# Altium schematic sheet Motor_Board.SchDoc
size A4; DrawnBy: Mike Cusdin; Organization: University of Canterbury; Address1: Electrical & Computer Eng; Address2: Private Bag 4800; Address3: Christchurch 8020; Address4: New Zealand; Revision: 2.0
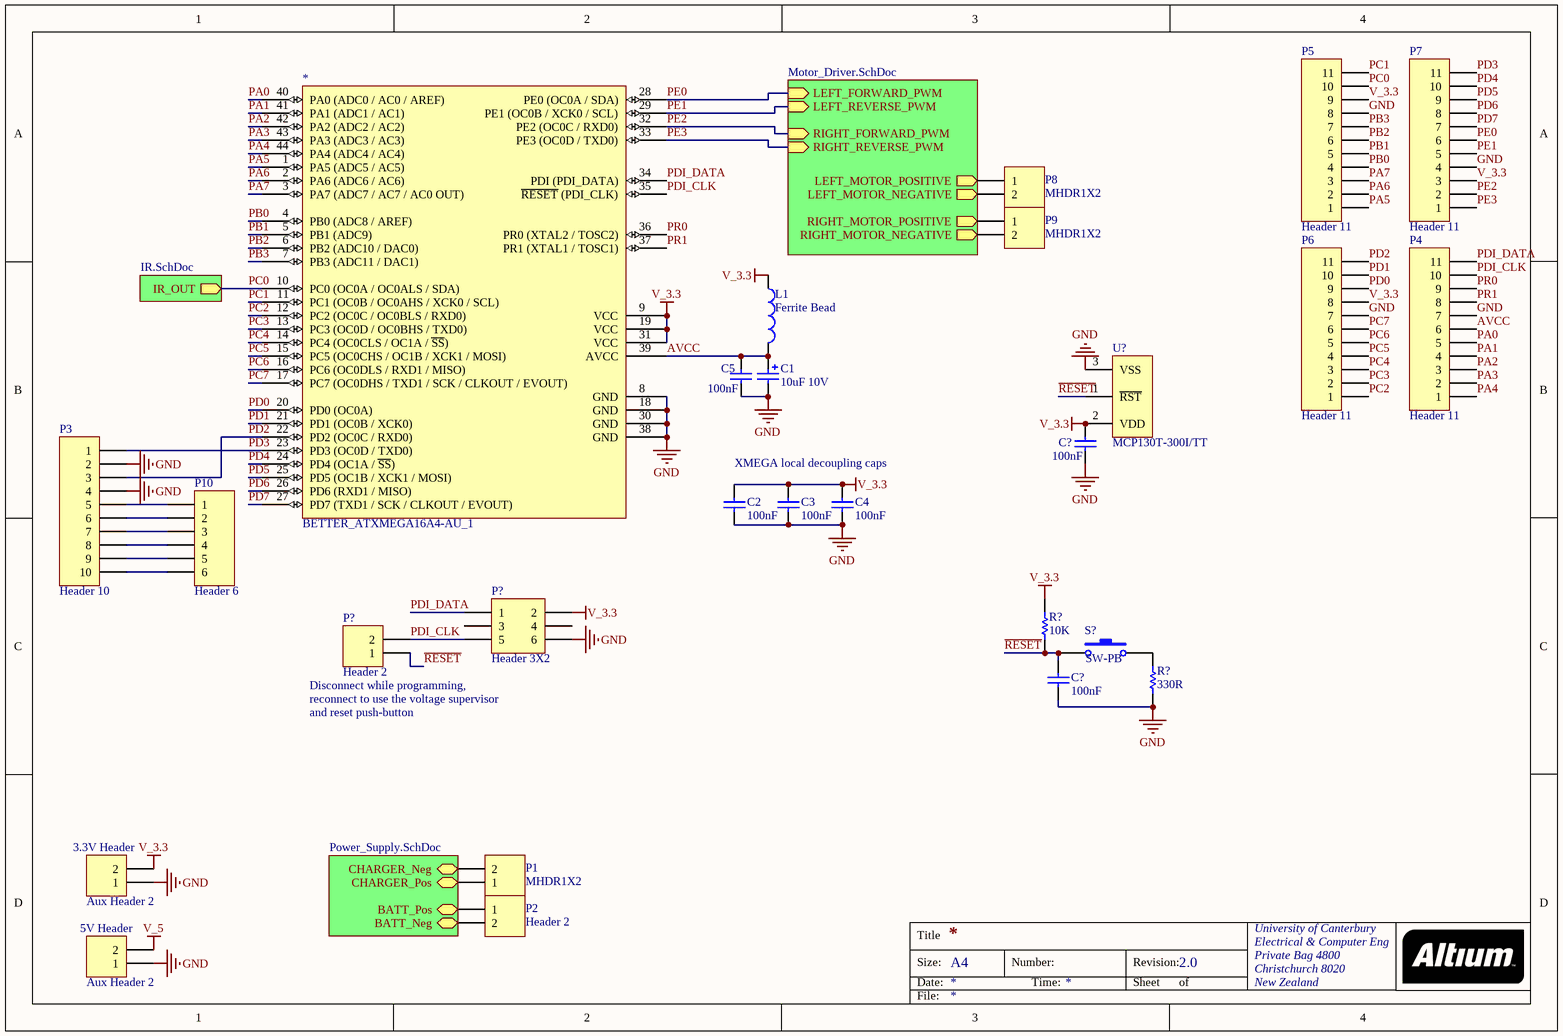
[diagram p0: Motor_Board.SchDoc]

## Parts
(Parts that share a designator on the sheet are numbered #1, #2 ... from top to bottom, then left to right.)
3.3V_Header  Aux Header 2  [TMHDR2]
5V_Header  Aux Header 2  [TMHDR2]
*  BETTER_ATXMEGA16A4-AU_1  [TQFP80P1200X1200X120-44N]
C1  10uF 10V  [TANT3216]
C2  100nF  [CC0603]
C3  100nF  [CC0603]
C4  100nF  [CC0603]
C5  100nF  [CC0603]
C?#1  100nF  [CC0603]
C?#2  100nF  [CC0603]
L1  Ferrite Bead  [R0805]
P1  MHDR1X2  [MHDR1X2]
P2  Header 2  [HDR1X2]
P3  Header 10  [HDR1X10]
P4  Header 11  [HDR1X11]
P5  Header 11  [HDR1X11]
P6  Header 11  [HDR1X11]
P7  Header 11  [HDR1X11]
P8  MHDR1X2  [MHDR1X2]
P9  MHDR1X2  [MHDR1X2]
P10  Header 6  [HDR1X6]
P?#1  Header 3X2  [HDR2X3]
P?#2  Header 2  [HDR1X2]
R?#1  10K  [R0603]
R?#2  330R  [R0603]
S?  SW-PB  [SPST-2]
U?  MCP130T-300I/TT  [SOT-23-TT3_N]

## Sub-sheets
? = Power_Supply.SchDoc: BATT_Pos, CHARGER_Neg, CHARGER_Pos, BATT_Neg
? = Motor_Driver.SchDoc: LEFT_FORWARD_PWM (in), RIGHT_FORWARD_PWM (in), LEFT_MOTOR_POSITIVE (out), RIGHT_MOTOR_POSITIVE (out), RIGHT_REVERSE_PWM (in), LEFT_REVERSE_PWM (in), RIGHT_MOTOR_NEGATIVE (out), LEFT_MOTOR_NEGATIVE (out)
? = IR.SchDoc: IR_OUT (out)

## Nets
GND: 3.3V_Header.?1(1) 5V_Header.?1(1) *.8(GND) *.18(GND) *.30(GND) *.38(GND) C1.2 C2.1 C3.1 C4.1 C5.1 C?#1.2 C?#2.2 P3.2 P3.4 P4.7 P5.8 P6.7 P7.4 P?#1.6 R?#2.1 U?.3(VSS)
V_3.3: 3.3V_Header.?2(2) *.9(VCC) *.19(VCC) *.31(VCC) C2.2 C3.2 C4.2 C?#1.1 L1.1 P5.9 P6.8 P7.3 P?#1.2 R?#1.2 U?.2(VDD)
V_5: 5V_Header.?2(2)
AVCC: *.39(AVCC) C1.1 C5.2 L1.2 P4.6
PA0: *.40(PA0_(ADC0_/_AC0_/_AREF)) P4.5
PA1: *.41(PA1_(ADC1_/_AC1)) P4.4
PA2: *.42(PA2_(ADC2_/_AC2)) P4.3
PA3: *.43(PA3_(ADC3_/_AC3)) P4.2
PA4: *.44(PA4_(ADC4_/_AC4)) P4.1
PA5: *.1(PA5_(ADC5_/_AC5)) P5.1
PA6: *.2(PA6_(ADC6_/_AC6)) P5.2
PA7: *.3(PA7_(ADC7_/_AC7_/_AC0_OUT)) P5.3
PB0: *.4(PB0_(ADC8_/_AREF)) P5.4
PB1: *.5(PB1_(ADC9)) P5.5
PB2: *.6(PB2_(ADC10_/_DAC0)) P5.6
PB3: *.7(PB3_(ADC11_/_DAC1)) P5.7
PC0: *.10(PC0_(OC0A_/_OC0ALS_/_SDA)) P5.10 ; sheet /IR_OUT
PC1: *.11(PC1_(OC0B_/_OC0AHS_/_XCK0_/_SCL)) P5.11
PC2: *.12(PC2_(OC0C_/_OC0BLS_/_RXD0)) P6.1
PC3: *.13(PC3_(OC0D_/_OC0BHS_/_TXD0)) P6.2
PC4: *.14(PC4_(OC0CLS_/_OC1A_/_~{SS})) P6.3
PC5: *.15(PC5_(OC0CHS_/_OC1B_/_XCK1_/_MOSI)) P6.4
PC6: *.16(PC6_(OC0DLS_/_RXD1_/_MISO)) P6.5
PC7: *.17(PC7_(OC0DHS_/_TXD1_/_SCK_/_CLKOUT_/_EVOUT)) P6.6
PD0: *.20(PD0_(OC0A)) P6.9
PD1: *.21(PD1_(OC0B_/_XCK0)) P6.10
PD2: *.22(PD2_(OC0C_/_RXD0)) P3.3 P6.11
PD3: *.23(PD3_(OC0D_/_TXD0)) P3.1 P7.11
PD4: *.24(PD4_(OC1A_/_~{SS})) P7.10
PD5: *.25(PD5_(OC1B_/_XCK1_/_MOSI)) P7.9
PD6: *.26(PD6_(RXD1_/_MISO)) P7.8
PD7: *.27(PD7_(TXD1_/_SCK_/_CLKOUT_/_EVOUT)) P7.7
PDI_CLK: *.35(~{RESET}_(PDI_CLK)) P4.10 P?#1.5 P?#2.2
PDI_DATA: *.34(PDI_(PDI_DATA)) P4.11 P?#1.1
PE0: *.28(PE0_(OC0A_/_SDA)) P7.6 ; sheet /LEFT_FORWARD_PWM
PE1: *.29(PE1_(OC0B_/_XCK0_/_SCL)) P7.5 ; sheet /LEFT_REVERSE_PWM
PE2: *.32(PE2_(OC0C_/_RXD0)) P7.2 ; sheet /RIGHT_FORWARD_PWM
PE3: *.33(PE3_(OC0D_/_TXD0)) P7.1 ; sheet /RIGHT_REVERSE_PWM
PR0: *.36(PR0_(XTAL2_/_TOSC2)) P4.9
PR1: *.37(PR1_(XTAL1_/_TOSC1)) P4.8
~{RESET}: C?#2.1 P?#2.1 R?#1.1 S?.1 U?.1(~{RST})
NetP1_1: P1.1 ; sheet /CHARGER_Pos
NetP1_2: P1.2 ; sheet /CHARGER_Neg
NetP2_1: P2.1 ; sheet /BATT_Pos
NetP2_2: P2.2 ; sheet /BATT_Neg
NetP3_5: P3.5 P10.1
NetP3_6: P3.6 P10.2
NetP3_7: P3.7 P10.3
NetP3_8: P3.8 P10.4
NetP3_9: P3.9 P10.5
NetP3_10: P3.10 P10.6
NetP8_1: P8.1 ; sheet /LEFT_MOTOR_POSITIVE
NetP8_2: P8.2 ; sheet /LEFT_MOTOR_NEGATIVE
NetP9_1: P9.1 ; sheet /RIGHT_MOTOR_POSITIVE
NetP9_2: P9.2 ; sheet /RIGHT_MOTOR_NEGATIVE
NetR?#2_2: R?#2.2 S?.2

Not connected (* = marked no-connect by the designer): P?#1 3 4

## Notes on the sheet
- XMEGA local decoupling caps
- (near P?#2) Disconnect while programming,
- (near P?#2) reconnect to use the voltage supervisor
- and reset push-button
- Title
- Size:
- Date:
- A4
- Number:
- Time:
- Revision:
- Sheet
- of
- File:

## Library data of the parts
3.3V_Header 5V_Header = Aux Header 2: 5.08mm Pluggable Terminal Header; LatestRevisionDate: 17-Jul-2002; LatestRevisionNote: Re-released for DXP Platform.; Publisher: Altium Limited
C1 = TANT10uF_10V_3216: SM Tantalum Cap; Supplier_Component_Code: RZ-6550; published: 12/03/2007 11:34:36 a.m.; Supplier_Name: Soanar Plus; price: 1.7; value: 10uF 10V; Part Number: TANT10uF_10V_3216; Component Kind: Standard; Component Type: Standard; Designator: TANT10uF_10V_3216; Pin Count: 2
C2-C5 C?#1 C?#2 = 100nF_CC0603: 0603 Capacitor; Supplier_Component_Code: RC-P100; published: 28/03/2007 10:54:57 a.m.; Supplier_Name: Soanar Plus; price: 0.09; value: 100nF; Part Number: 100nF_CC0603; Component Kind: Standard; Component Type: Standard; Designator: 100nF_CC0603; Pin Count: 2
L1 = L805: Ferrite Bead Inductor; Value: 100R; Published: 8-Jun-2000; LatestRevisionDate: 17-Jul-2002; Publisher: Altium Limited; price: 0.11; Supplier_Component_Code: LF-P308; Supplier_Name: Soanar Plus; Part Number: L805; Component Kind: Standard; Component Type: Standard; Designator: L805; Pin Count: 2; Signal Integrity: Inductor; Simulation: INDUCTOR
P1 P8 P9 = MHDR1X2: Header, 2-Pin; LatestRevisionDate: 17-Jul-2002; LatestRevisionNote: Re-released for DXP Platform.; Publisher: Altium Limited
P2 P?#2 = Header 2: Header, 2-Pin; LatestRevisionDate: 17-Jul-2002; LatestRevisionNote: Re-released for DXP Platform.; Publisher: Altium Limited
P3 = Header 10: Header, 10-Pin; LatestRevisionDate: 17-Jul-2002; LatestRevisionNote: Re-released for DXP Platform.; Publisher: Altium Limited
P4-P7 = Header 11: Header, 11-Pin; LatestRevisionDate: 17-Jul-2002; LatestRevisionNote: Re-released for DXP Platform.; Publisher: Altium Limited
P10 = Header 6: Header, 6-Pin; LatestRevisionDate: 17-Jul-2002; LatestRevisionNote: Re-released for DXP Platform.; Publisher: Altium Limited
P?#1 = Header 3X2: Header, 3-Pin, Dual row; LatestRevisionDate: 17-Jul-2002; LatestRevisionNote: Re-released for DXP Platform.; Publisher: Altium Limited
R?#1 = 10K_R0603: 0603 Resistor; ECE_Component_Code: 10K_R0603; value: 10K; Supplier_Component_Code: RS-S097; published: 12/03/2007 11:34:34 a.m.; Supplier_Name: Soanar Plus; price: 0.08; Part Number: 10K_R0603; Component Kind: Standard; Component Type: Standard; Designator: 10K_R0603; Pin Count: 2
R?#2 = 330R_R0603: 0603 Resistor; ECE_Component_Code: 330R_R0603; value: 330R; Supplier_Component_Code: RS-S061; published: 12/03/2007 11:34:34 a.m.; Supplier_Name: Soanar Plus; price: 0.08; Part Number: 330R_R0603; Component Kind: Standard; Component Type: Standard; Designator: 330R_R0603; Pin Count: 2
S? = SW-PB: Switch; Published: 24-Mar-1999; LatestRevisionDate: 17-Jul-2002; LatestRevisionNote: Re-released for DXP Platform.; PackageReference: SPST-2; Publisher: Altium Limited
U? = MCP130T-300I/TT: Microcontroller Supervisory Circuit with Open Drain Output, 3-Pin SOT-23, Industrial Temperature, Tape and Reel; FirstPublished: 29-Jan-2009; DatasheetVersion: revD, 2001; PackageVersion: revBB, Aug-2009; PackageReference: SOT-23-TT3; Publisher: Altium Limited; PackageDescription: 3-Lead Plastic Small Outline Transistor (TT) [SOT-23]; Supplier 1: Digi-Key; Supplier Part Number 1: MCP130T-300I/TTTR-ND; Supplier 2: Digi-Key; Supplier Part Number 2: MCP130T-300I/TTCT-ND; Supplier 3: Digi-Key; Supplier Part Number 3: MCP130T-300I/TTDKR-ND; Supplier 4: Farnell; Supplier Part Number 4: 1332070; Supplier 5: Newark; Supplier Part Number 5: 19C7176; Code_IPC: SOT23-3; ComponentLink1Description: Datasheet; ComponentLink1URL: http://ww1.microchip.com/downloads/en/DeviceDoc/11184d.pdf; ComponentLink2Description: Packaging Specification; ComponentLink2URL: http://www.microchip.com/stellent/groups/techpub_sg/documents/packagingspec/en012702.pdf; ComponentLink3Description: Microchip.com Home; ComponentLink3URL: http://www.microchip.com/